# EAGLE design RGB_i2c_v1 (EAGLE 6.2)
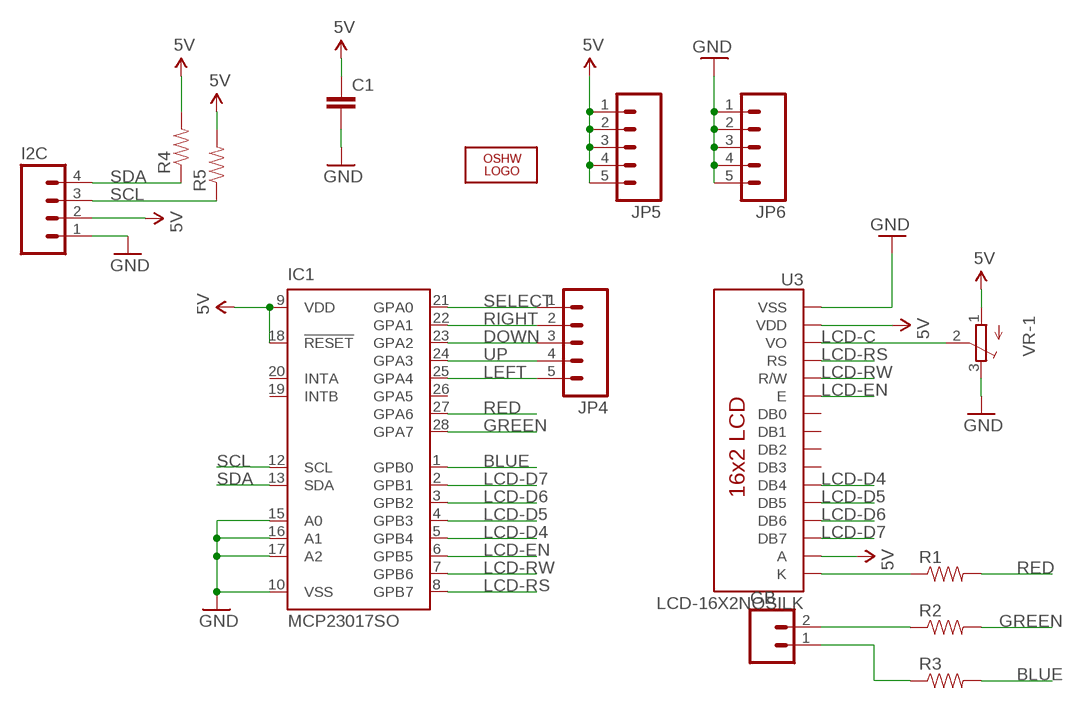
[diagram p0: schematic, sheet 1]

## Parts
C1  CAP0805  [0805]
GB  M02LOCK  [1X02_LOCK]
I2C  M04LOCK  [1X04_LOCK]
IC1  MCP23017SO  [SO28W]
JP4  M05LOCK  [1X05_LOCK]
JP5  M05LOCK  [1X05_LOCK]
JP6  M05LOCK  [1X05_LOCK]
LOGO2  OSHW_LOGO_10MILX0350-NT  [OSHW_10X350_NOTEXT]
R1  RESISTOR0805-RES  [0805]
R2  RESISTOR0805-RES  [0805]
R3  RESISTOR0805-RES  [0805]
R4  RESISTOR0805-RES  [0805]
R5  RESISTOR0805-RES  [0805]
U3  LCD-16X2NOSILK  [LCD-16X2_NOSILK]
VR-1  TRIMPOTTC33X  [TC33X]

## Nets
5V: C1.1 I2C.2 IC1.9(VDD) IC1.18(!RESET) JP5.1 JP5.2 JP5.3 JP5.4 JP5.5 R4.2 R5.2 U3.2(VDD) U3.15(A) VR-1.1(A)
BLUE: IC1.1(GPB0) R3.2
DOWN: IC1.23(GPA2) JP4.3
GND: C1.2 I2C.1 IC1.10(VSS) IC1.15(A0) IC1.16(A1) IC1.17(A2) JP6.1 JP6.2 JP6.3 JP6.4 JP6.5 U3.1(VSS) VR-1.3(E)
GREEN: IC1.28(GPA7) R2.2
LCD-C: U3.3(VO) VR-1.2(S)
LCD-D4: IC1.5(GPB4) U3.11(DB4)
LCD-D5: IC1.4(GPB3) U3.12(DB5)
LCD-D6: IC1.3(GPB2) U3.13(DB6)
LCD-D7: IC1.2(GPB1) U3.14(DB7)
LCD-EN: IC1.6(GPB5) U3.6(E)
LCD-RS: IC1.8(GPB7) U3.4(RS)
LCD-RW: IC1.7(GPB6) U3.5(R/W)
LEFT: IC1.25(GPA4) JP4.5
N$1: GB.2 R2.1
N$2: GB.1 R3.1
N$4: R1.1 U3.16(K)
RED: IC1.27(GPA6) R1.2
RIGHT: IC1.22(GPA1) JP4.2
SCL: I2C.3 IC1.12(SCL) R5.1
SDA: I2C.4 IC1.13(SDA) R4.1
SELECT: IC1.21(GPA0) JP4.1
UP: IC1.24(GPA3) JP4.4
Unconnected: IC1.19(INTB) IC1.20(INTA) IC1.26(GPA5) U3.7(DB0) U3.8(DB1) U3.9(DB2) U3.10(DB3)

## Library data of the parts
C1 = SparkFun:CAP: Capacitor Standard 0603 ceramic capacitor, and 0.1" leaded capacitor.
GB = SparkFun:M02: Header 2 Standard 2-pin 0.1" header. Use with straight break away headers (SKU : PRT-00116), right angle break away headers (PRT-00553), swiss pins (PRT-00743), machine pins (PRT-00117), and female headers (PRT-00115). Molex polarized connector foot print use with SKU : PRT-08233 with associated crimp pins and housings.
I2C = SparkFun:M04: Header 4 Standard 4-pin 0.1" header. Use with straight break away headers (SKU : PRT-00116), right angle break away headers (PRT-00553), swiss pins (PRT-00743), machine pins (PRT-00117), and female headers (PRT-00115). Molex polarized connector foot print use with SKU : PRT-08231 with associated crimp pins and housings. 1MM SMD Version SKU: PRT-10208
IC1 = adafruit:MCP23017: http://ww1.microchip.com/downloads/en/DeviceDoc/21952a.pdf Source: http://ww1.microchip.com/downloads/en/DeviceDoc/21952a.pdf
JP4-JP6 = SparkFun:M05: Header 5 Standard 5-pin 0.1" header. Use with straight break away headers (SKU : PRT-00116), right angle break away headers (PRT-00553), swiss pins (PRT-00743), machine pins (PRT-00117), and female headers (PRT-00115). Molex polarized connector foot print use with SKU : PRT-08230 with associated crimp pins and housings.
LOGO2 = ohw-logo:OSHW_LOGO_10MIL
R1-R5 = SparkFun:RESISTOR: Resistor Basic schematic elements and footprints for 0603, 1206, and PTH resistors.
U3 = SparkFun:LCD-16X2
VR-1 = adafruit:TRIMPOT: SMT trimmer potentiometer part number TC33X http://www.ladyada.net/library/eagle

## Board
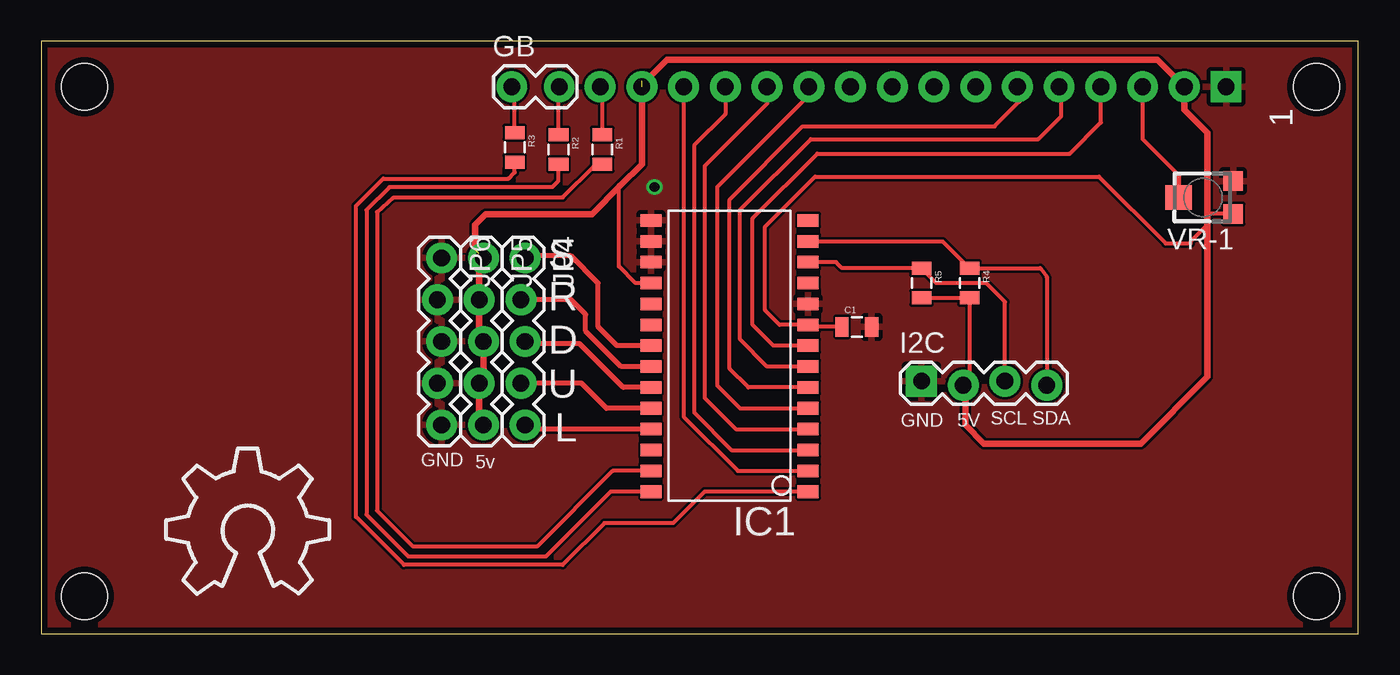
[diagram p1: board, top side]
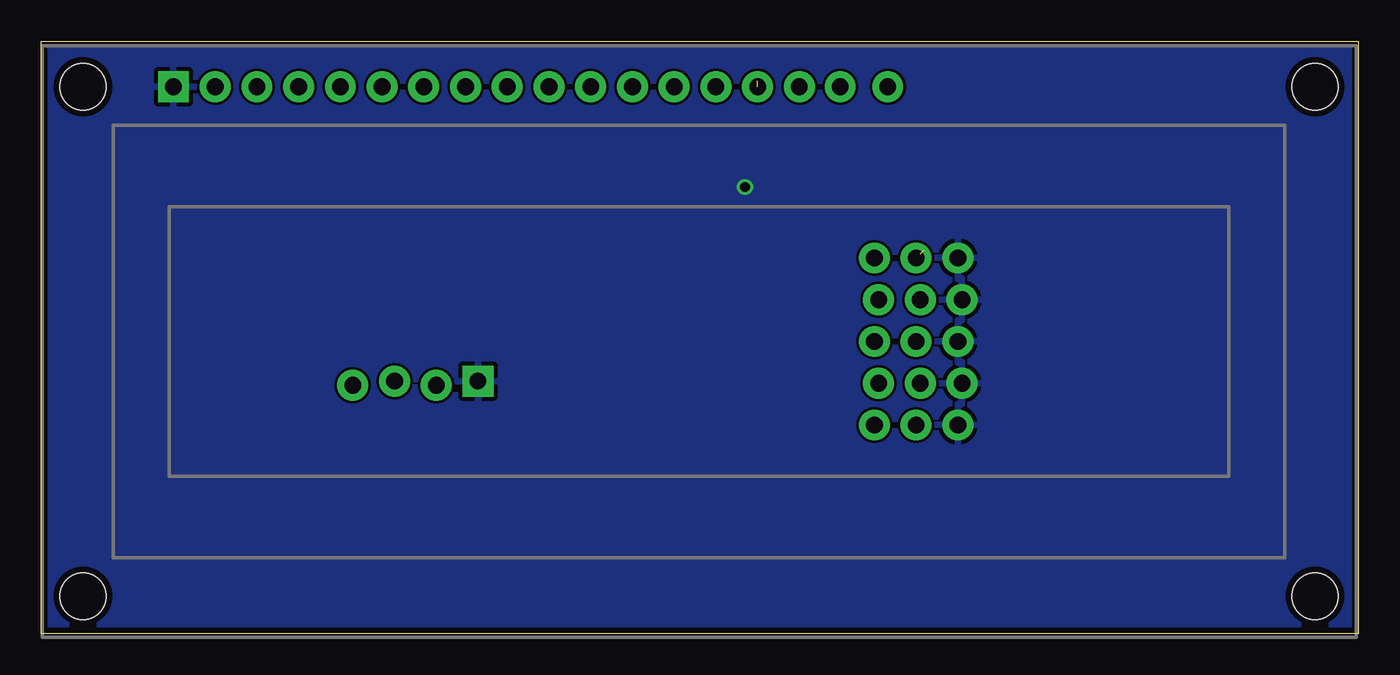
[diagram p2: board, bottom side, seen from below]

Size 80.19 x 36.06 mm. Coordinates in mm from the lower left corner, seen from the top.
Outline: 0,0 80.19,0 80.19,36.06 0,36.06 0,0
Copper layers (1*16): Top 0.0356mm / dielectric 1.5011mm / Bottom 0.0356mm
Design rules: minimum track width 6mil, minimum drill 13mil, track to track 6mil, track to pad 6mil, pad to pad 6mil, via to via 6mil, smd to smd 6mil, copper to edge 15mil, drill to drill 6mil, minimum pad ring 7mil, minimum via ring 7mil, stop-mask expansion 4mil, vias tented up to drill 0mil, thermal gap 10mil

### Footprints (pad centres in the part's own frame; a part is rotated, then mirrored left to right if it is on the bottom)
0805 = smd 0.8 x 1.2: 1 -0.9,0; 2 0.9,0
1X02_LOCK = drill 1.016 pad 1.88: 1 -0.178,0; 2 2.718,0
1X04_LOCK = drill 1.016 pad 1.88 square: 1 0,0.127 | drill 1.016 pad 1.88: 2 2.54,-0.127; 3 5.08,0.127; 4 7.62,-0.127
SO28W = smd 0.762 x 1.27: 1 -7.62,-4.78; 2 -6.35,-4.78; 3 -5.08,-4.78; 4 -3.81,-4.78; 5 -2.54,-4.78; 6 -1.27,-4.78; 7 0,-4.78; 8 1.27,-4.78; 9 2.54,-4.78; 10 3.81,-4.78; 11 5.08,-4.78; 12 6.35,-4.78; 13 7.62,-4.78; 14 8.89,-4.78; 15 8.89,4.78; 16 7.62,4.78; 17 6.35,4.78; 18 5.08,4.78; 19 3.81,4.78; 20 2.54,4.78; 21 1.27,4.78; 22 0,4.78; 23 -1.27,4.78; 24 -2.54,4.78; 25 -3.81,4.78; 26 -5.08,4.78; 27 -6.35,4.78; 28 -7.62,4.78
1X05_LOCK = drill 1.016 pad 1.88: 1 0,0.127; 2 2.54,-0.127; 3 5.08,0.127; 4 7.62,-0.127; 5 10.16,0.127
LCD-16X2_NOSILK = drill 1.016 pad 1.88 square: 1 -32,15.5 | drill 1.016 pad 1.88: 2 -29.46,15.5; 3 -26.92,15.5; 4 -24.38,15.5; 5 -21.84,15.5; 6 -19.3,15.5; 7 -16.76,15.5; 8 -14.22,15.5; 9 -11.68,15.5; 10 -9.14,15.5; 11 -6.6,15.5; 12 -4.06,15.5; 13 -1.52,15.5; 14 1.02,15.5; 15 3.56,15.5; 16 6.1,15.5 | hole 2.8: -37.5,15.5; -37.5,-15.5; 37.5,15.5; 37.5,-15.5
TC33X = smd 1.2 x 1.2: 1 -1,-1.825; 3 1,-1.825 | smd 1.5 x 1.6: 2 0,1.5

### Placement (x,y rotation side)
C1  49.66,18.67 0 top
GB  28.83,33.27 0 top
I2C  53.59,15.24 0 top
IC1  41.91,16.26 90 top
JP4  29.34,22.86 270 top
JP5  26.8,22.86 270 top
JP6  24.26,22.86 270 top
LOGO2  7.62,2.41 0 top
R1  34.16,29.46 270 top
R2  31.5,29.46 270 top
R3  28.83,29.59 270 top
R4  56.52,21.34 270 top
R5  53.59,21.34 270 top
U3  40.13,17.78 0 bottom
VR-1  70.74,26.54 90 top

### Tracks (layer width: path | path; a pad name or v marks a point on that pad's centre or on a via)
5V  (2 unrouted)
  Top 0.254: R5.2 R4.2 56.52,15.49 I2C.2 56.26,14.99 | 70.99,25.4 71.14,25.54 VR-1.1 | 26.92,23.37 26.67,23.11 26.67,23.62 | C1.1 46.82,18.67 IC1.9 44.96,18.8 44.07,19.68 44.07,24.77 47.12,27.81 64.39,27.81 68.45,23.75 69.98,23.75 69.98,23.88 70.99,24.89 | IC1.18 36.2,21.34 35.18,22.35 35.18,27.3 35.24,27.24
  Top 0.406: 56.26,14.99 56.26,12.7 57.4,11.56 66.93,11.56 70.99,15.62 70.99,24.89 70.99,25.4 70.99,30.48 69.6,31.88 U3.2 67.95,34.92 38.1,34.92 36.83,33.65 36.57,33.65 | 26.67,23.11 JP5.2 26.67,18.03 JP5.3 26.92,15.49 JP5.4 26.67,12.95 JP5.5 26.8,12.57 | U3.15 36.57,28.57 35.24,27.24 33.53,25.53 27.05,25.53 26.42,24.89 26.42,23.37 JP5.1
BLUE
  Top 0.254: IC1.1 40.39,8.64 38.48,6.73 34.29,6.73 31.75,4.19 22.1,4.19 19.18,7.11 19.18,26.04 20.83,27.69 28.45,27.69 28.83,28.07 R3.2
DOWN
  Top 0.305: IC1.23 35.43,14.99 32.77,17.65 29.59,17.65 JP4.3
GND  (via drill 0.6)
  other vias: 37.34,27.18
  pour Top: -8.64,-13.97 94.23,-13.97 94.23,53.34 -8.64,53.34
  pour Bottom: -6.35,-5.84 86.11,-5.84 86.11,43.94 -6.35,43.94 -6.35,-5.08
GREEN
  Top 0.254: IC1.28 34.67,8.64 30.73,4.7 22.35,4.7 19.81,7.24 19.81,25.78 21.21,27.18 31.11,27.18 31.5,27.56 R2.2
LCD-C
  Top 0.254: 69.24,27.92 67.06,30.1 U3.3
  Top 0.305: U3.3 | 69.24,27.92 VR-1.2
LCD-D4
  Top 0.254: U3.11 46.73,32.76 41.15,27.18 41.15,15.11 42.55,13.72 IC1.5
LCD-D5
  Top 0.254: U3.12 44.19,32.25 40.39,28.45 40.39,14.35 42.29,12.45 IC1.4
LCD-D6
  Top 0.254: U3.13 41.65,31.62 39.75,29.72 39.75,13.46 42.04,11.18 IC1.3
LCD-D7
  Top 0.254: U3.14 39.11,13.21 42.42,9.91 IC1.2
LCD-EN
  Top 0.254: IC1.6 43.05,14.99 41.91,16.13 41.91,26.42 46.35,30.86 58.04,30.86 59.56,32.38 59.56,33.15 U3.6
LCD-RS
  Top 0.254: IC1.8 44.58,17.53 43.31,18.8 43.31,25.27 47.24,29.21 62.61,29.21 64.52,31.11 U3.4
LCD-RW
  Top 0.254: IC1.7 44.2,16.26 42.55,17.91 42.55,25.78 46.86,30.1 60.71,30.1 62.1,31.5 62.1,33.15 U3.5
LEFT
  Top 0.305: IC1.25 29.72,12.45 JP4.5
N$1
  Top 0.254: R2.1 31.5,33.22 GB.2
N$2
  Top 0.254: R3.1 28.83,33.1 GB.1
N$4
  Top 0.254: R1.1 34.16,33.15 U3.16
RED
  Top 0.254: IC1.27 34.8,9.91 30.23,5.33 22.61,5.33 20.45,7.49 20.45,25.65 21.46,26.54 31.75,26.54 33.66,28.45 34.05,28.45 R1.2 33.77,28.56
RIGHT
  Top 0.305: IC1.22 35.31,16.26 33.15,18.41 33.15,19.43 32.26,20.32 JP4.2
SCL
  Top 0.254: I2C.3 58.67,20.19 57.53,21.34 54.49,21.34 R5.1 48.76,22.24 48.39,22.61 IC1.12
SDA
  Top 0.254: IC1.13 54.88,23.88 R4.1 60.82,22.24 61.21,21.72 I2C.4
SELECT
  Top 0.305: IC1.21 35.05,17.53 33.91,18.67 33.91,21.34 32.26,22.99 29.59,22.99 JP4.1
UP
  Top 0.305: IC1.24 34.42,13.72 32.89,15.24 JP4.4

### Text on the board
tNames: 1 | S | R | D | U | GND | 5V | SCL | SDA | L | GND | 5v